# Altium schematic sheet Batteries.SchDoc
size A4
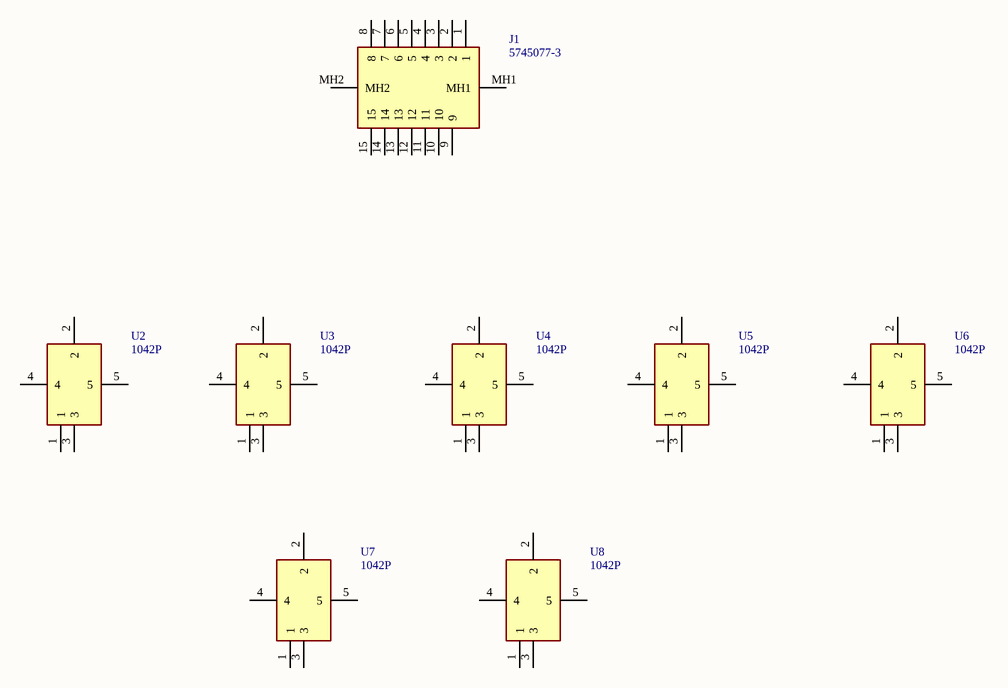
[diagram p0: Batteries.SchDoc]

## Parts
J1  5745077-3  [57450773]
U2  1042P  [1042P]
U3  1042P  [1042P]
U4  1042P  [1042P]
U5  1042P  [1042P]
U6  1042P  [1042P]
U7  1042P  [1042P]
U8  1042P  [1042P]

## Nets

Not connected (* = marked no-connect by the designer): J1 1 2 3 4 5 6 7 8 9 10 11 12 13 14 15 MH1 MH2; U2 1 2 3 4 5; U3 1 2 3 4 5; U4 1 2 3 4 5; U5 1 2 3 4 5; U6 1 2 3 4 5; U7 1 2 3 4 5; U8 1 2 3 4 5

## Library data of the parts
J1 = 5745077-3: Connector; Manufacturer_Name: TE Connectivity; Datasheet Link: https://www.te.com/commerce/DocumentDelivery/DDEController?Action=srchrtrv&DocNm=5745077&DocType=Customer+Drawing&DocLang=English; Height: 12.55mm; Manufacturer_Part_Number: 5745077-3
U2-U8 = 1042P: Undefined or Miscellaneous; Manufacturer_Name: Keystone Electronics; Datasheet Link: http://www.keyelco.com/product-pdf.cfm?p=13957; Height: 14mm; Manufacturer_Part_Number: 1042P; Arrow Part Number: 1042P; Arrow Price/Stock: https://www.arrow.com/en/products/1042p/keystone-electronics; Mouser Part Number: 534-1042P; Mouser Price/Stock: https://www.mouser.co.uk/ProductDetail/Keystone-Electronics/1042P?qs=g2rIOKKlpoboHyq0g1zn1A%3D%3D